# EasyEDA Pro project SRM_SuperCapacitor_S23_S24_.epro, schematic SCAP_Manage

## Sheets
1 主控: Create Date: 2024-01-11; Page Name: 主控; Project Name: TYT_SCAP_HW传家宝; Schematic Name: 超级电容管理_3; Update Date: 2024-01-11; Company: 嘉立创EDA; Page Size: B; Version: V1.0
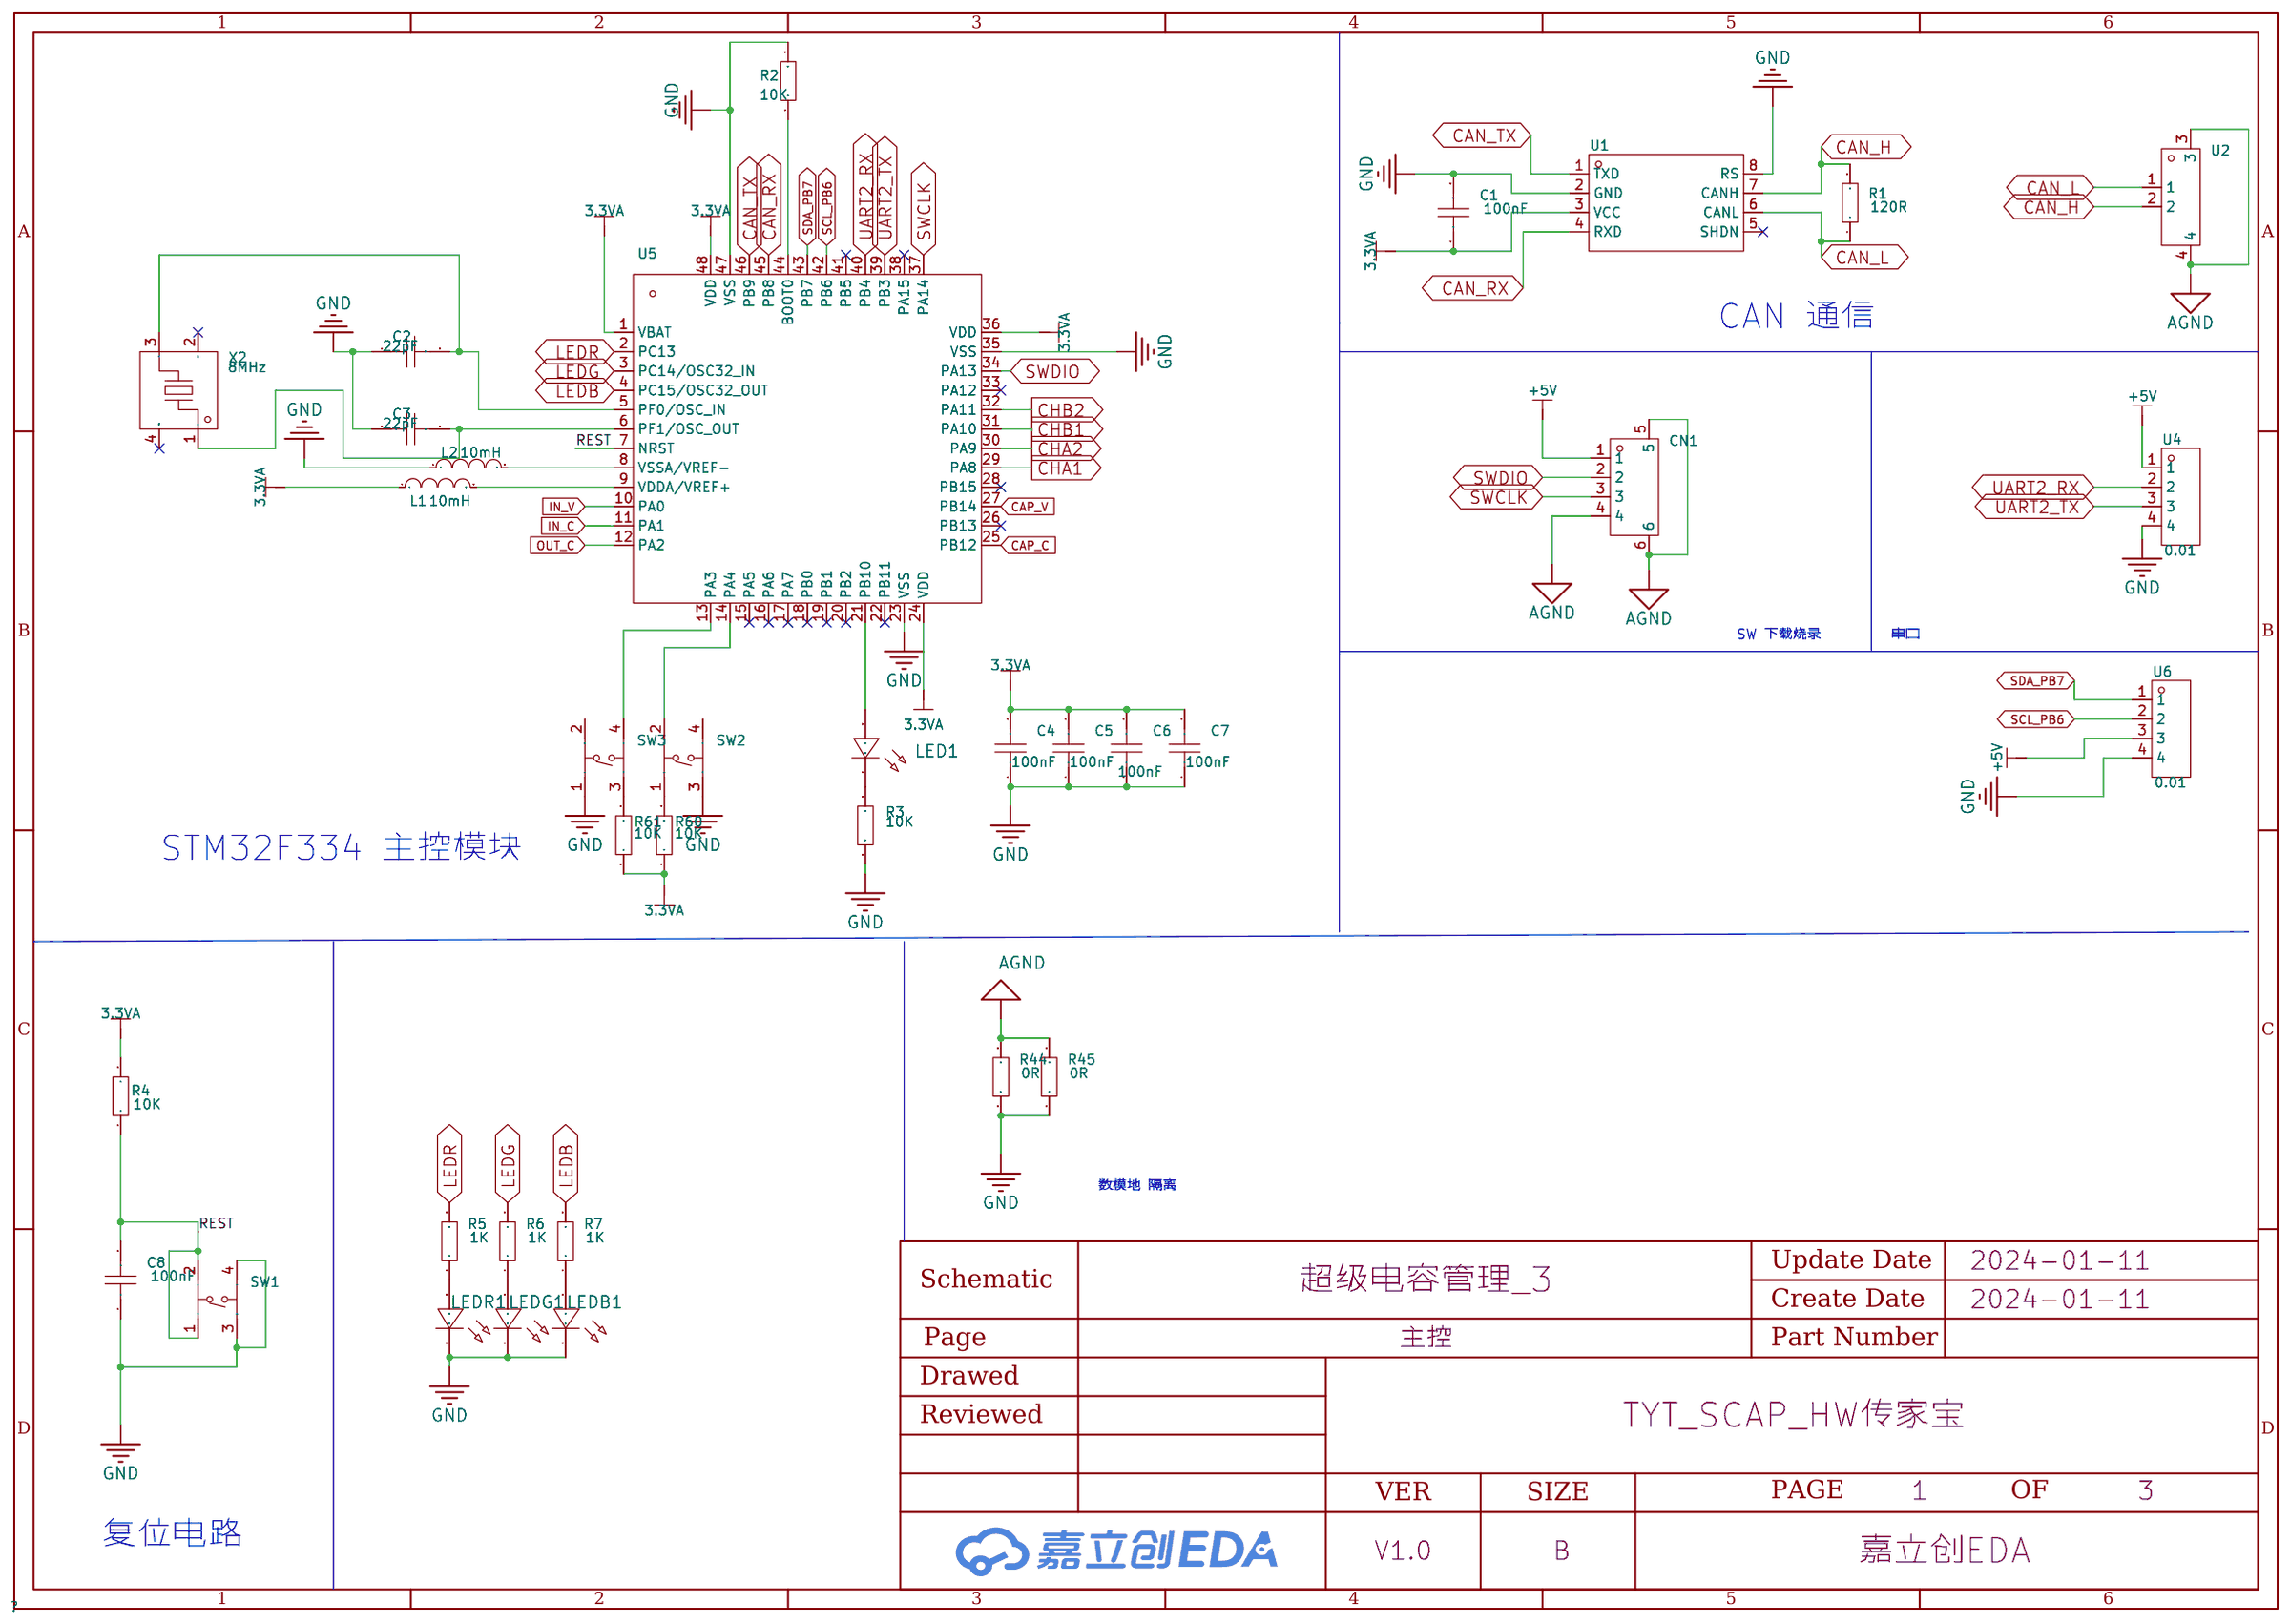
[diagram p0: 主控]
2 电源部分: Page Name: 电源部分; Project Name: SCAP_S23_S24; Schematic Name: SCAP_Manage; Update Date: 2024-04-11; Page Size: A4
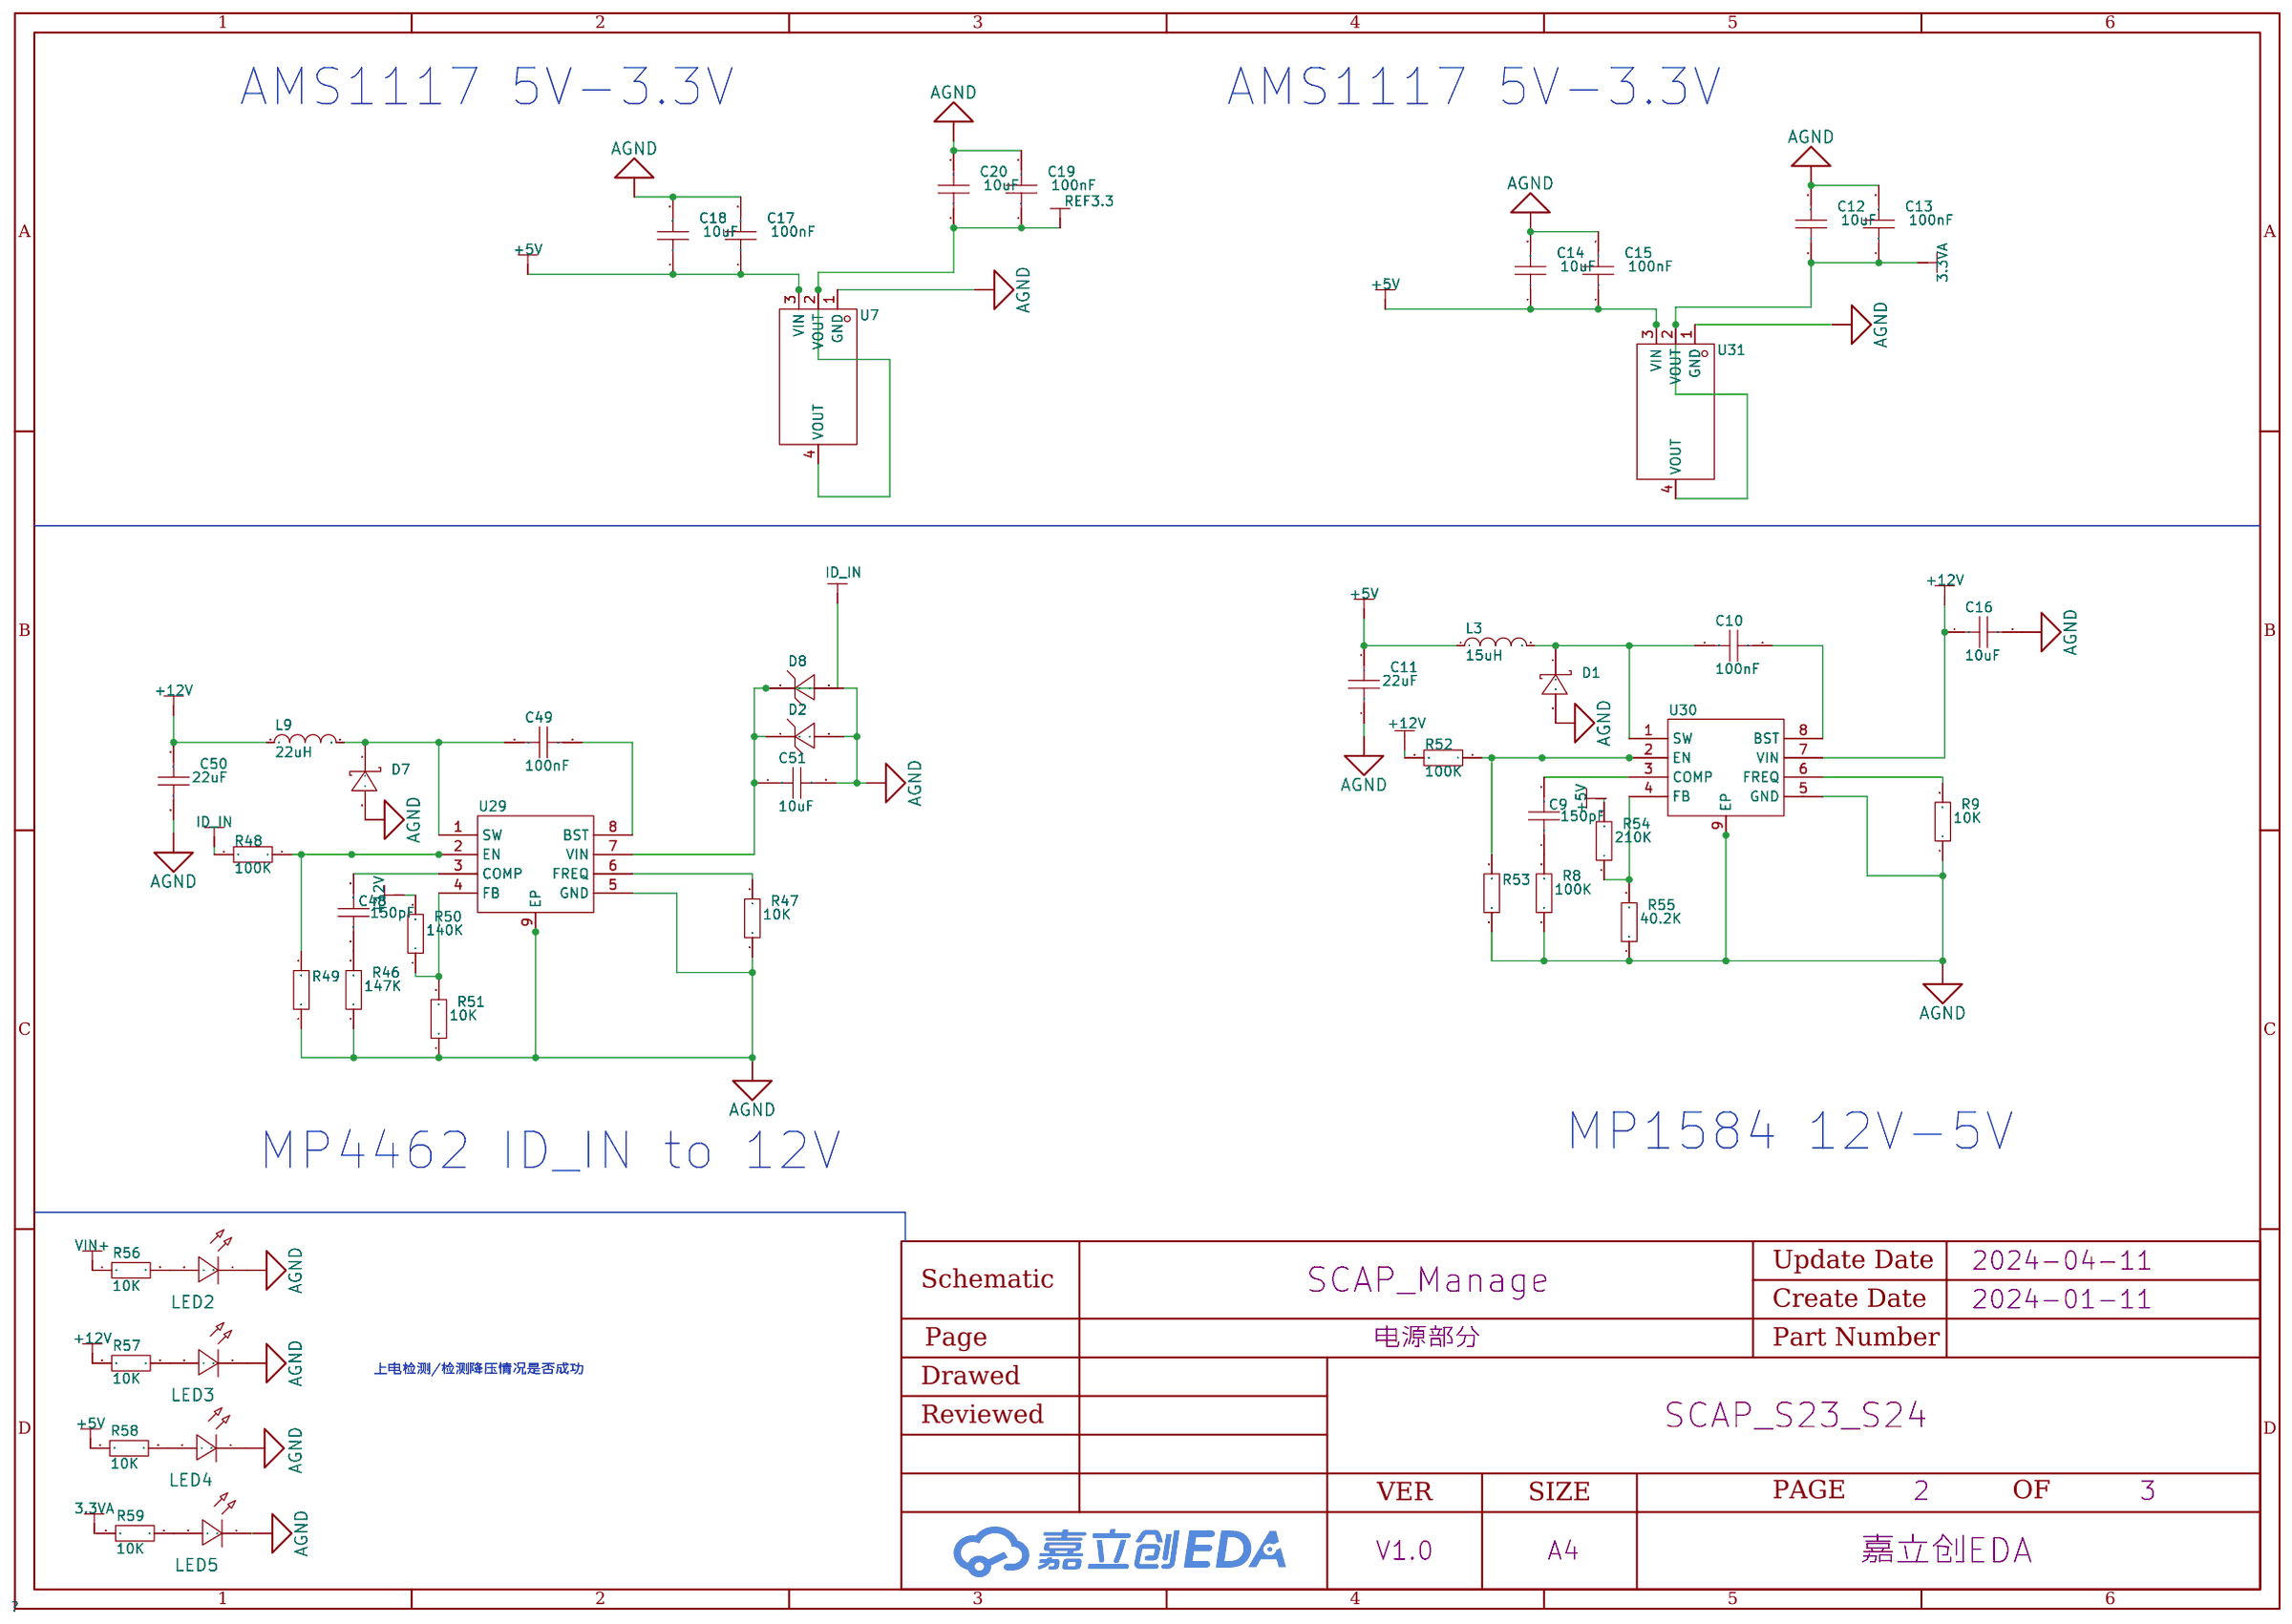
[diagram p1: 电源部分]
3 主拓扑: Page Name: 主拓扑; Project Name: SCAP_S23_S24; Schematic Name: SCAP_Manage; Update Date: 2024-05-25
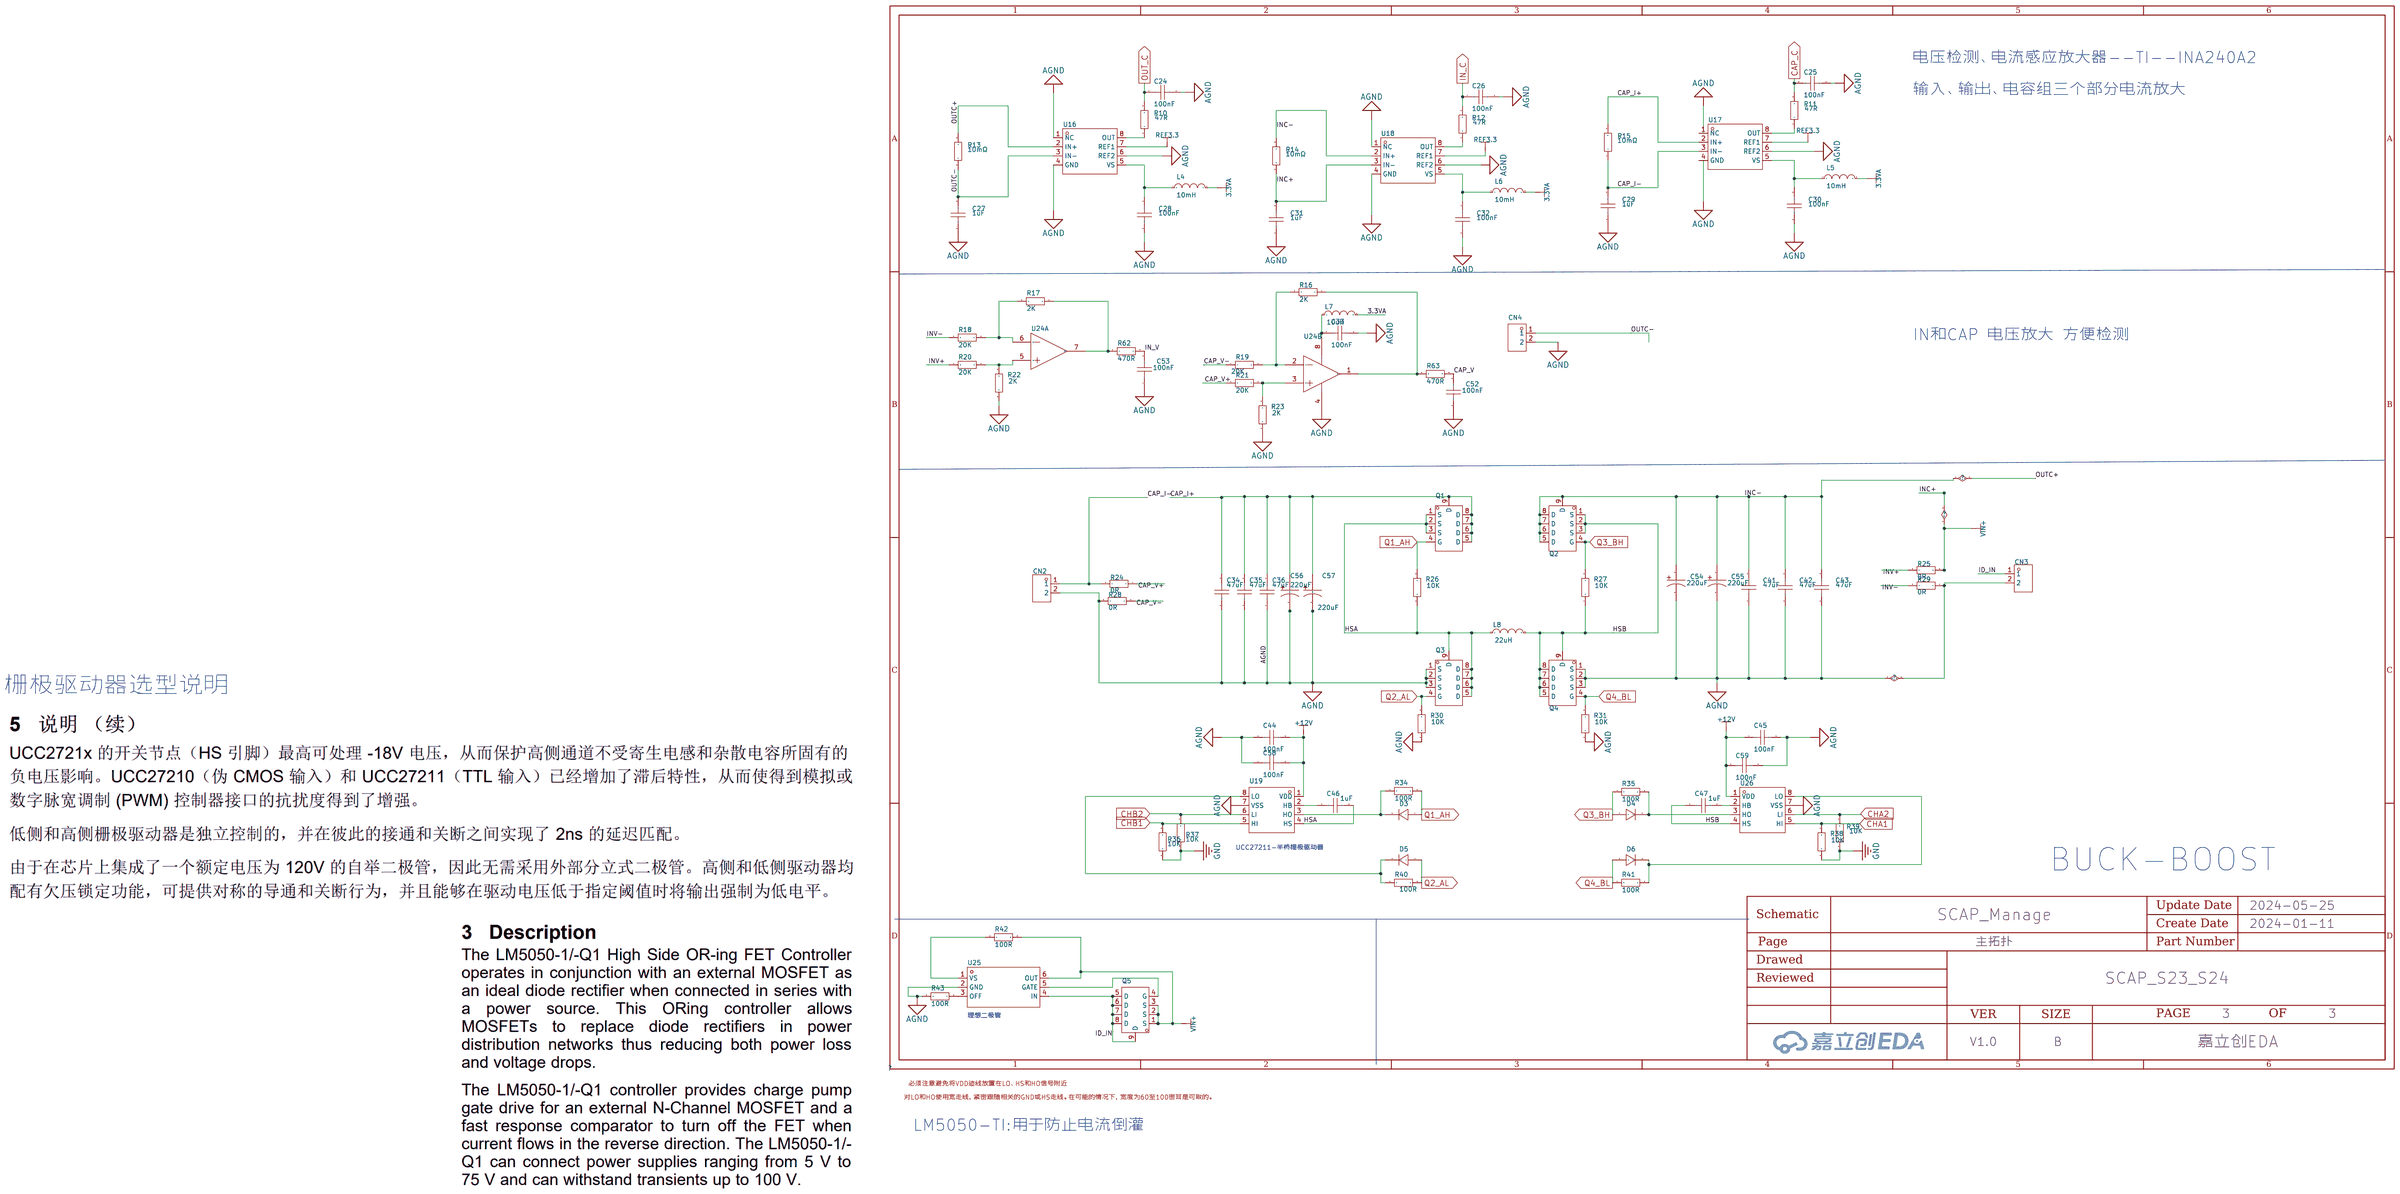
[diagram p2: 主拓扑]

## Parts
sheet 主拓扑
C24  100nF  [C0603]
C25  100nF  [C0603]
C26  100nF  [C0603]
C27  1uF  [C1206]
C28  100nF  [C0603]
C29  1uF  [C1206]
C30  100nF  [C0603]
C31  1uF  [C1206]
C32  100nF  [C0603]
C33  100nF  [C0603]
C34  47uF  [C1206]
C35  47uF  [C1206]
C36  47uF  [C1206]
C41  47uF  [C1206]
C42  47uF  [C1206]
C43  47uF  [C1206]
C44  100nF  [C0805]
C45  100nF  [C0805]
C46  1uF  [C0603]
C47  1uF  [C0603]
C52  100nF  [C0603]
C53  100nF  [C0603]
C54  220uF  [CAP-SMD_BD10.0-L10.3-W10.3-FD]
C55  220uF  [CAP-SMD_BD10.0-L10.3-W10.3-FD]
C56  220uF  [CAP-SMD_BD10.0-L10.3-W10.3-FD]
C57  220uF  [CAP-SMD_BD10.0-L10.3-W10.3-FD]
C58  100nF  [C0603]
C59  100nF  [C0603]
CN2  XT30U-M  [CONN-TH_XT30U-M]
CN3  XT30U-M  [CONN-TH_XT30U-M]
CN4  XT30U-M  [CONN-TH_XT30U-M]
D3  LL4148  [LL-34_L3.5-W1.5-R-RD]
D4  LL4148  [LL-34_L3.5-W1.5-R-RD]
D5  LL4148  [LL-34_L3.5-W1.5-R-RD]
D6  LL4148  [LL-34_L3.5-W1.5-R-RD]
L4  10mH  [L0603]
L5  10mH  [L0603]
L6  10mH  [L0603]
L7  10uH  [L0603]
L8  22uH  [IND-SMD_L17.5-W17.5]
Q1  CSD19534Q5A  [POWERVDFN-8_L6.0-W5.0-P1.27-BL]
Q2  CSD19534Q5A  [POWERVDFN-8_L6.0-W5.0-P1.27-BL]
Q3  CSD19534Q5A  [POWERVDFN-8_L6.0-W5.0-P1.27-BL]
Q4  CSD19534Q5A  [POWERVDFN-8_L6.0-W5.0-P1.27-BL]
Q5  CSD19534Q5A  [POWERVDFN-8_L6.0-W5.0-P1.27-BL]
R10  47R  [R0603]
R11  47R  [R0603]
R12  47R  [R0603]
R13  10mΩ  [R2512]
R14  10mΩ  [R2512]
R15  10mΩ  [R2512]
R16  2K  [R0603]
R17  2K  [R0603]
R18  20K  [R0603]
R19  20K  [R0603]
R20  20K  [R0603]
R21  20K  [R0603]
R22  2K  [R0603]
R23  2K  [R0603]
R24  0R  [R0603]
R25  0R  [R0603]
R26  10K  [R0603]
R27  10K  [R0603]
R28  0R  [R0603]
R29  0R  [R0603]
R30  10K  [R0603]
R31  10K  [R0603]
R34  100R  [R0603]
R35  100R  [R0603]
R36  10K  [R0603]
R37  10K  [R0603]
R38  10K  [R0603]
R39  10K  [R0603]
R40  100R  [R0603]
R41  100R  [R0603]
R42  100R  [R0603]
R43  100R  [R0603]
R62  470R  [R0603]
R63  470R  [R0603]
U16  INA240A2QPWRQ1  [TSSOP-8_L4.4-W3.0-P0.65-LS6.4-BL]
U17  INA240A2QPWRQ1  [TSSOP-8_L4.4-W3.0-P0.65-LS6.4-BL]
U18  INA240A2QPWRQ1  [TSSOP-8_L4.4-W3.0-P0.65-LS6.4-BL]
U19  UCC27211D  [SOIC-8_L4.9-W3.9-P1.27-LS6.0-BL]
U24  OPA2350UA/2K5  [SOIC-8_L4.9-W3.9-P1.27-LS6.0-BL]  (sections 1,2)
U25  LM5050MK-1/NOPB  [TSOT-23-6_L2.9-W1.6-P0.95-LS2.8-BR]
U26  UCC27211D  [SOIC-8_L4.9-W3.9-P1.27-LS6.0-BL]
sheet 主控
C1  100nF  [C0603]
C2  22pF  [C0603]
C3  22pF  [C0603]
C4  100nF  [C0603]
C5  100nF  [C0603]
C6  100nF  [C0603]
C7  100nF  [C0603]
C8  100nF  [C0603]
CN1  HC-1.25-4PLT  [CONN-SMD 4P-P1.25-L]
L1  10mH  [L0603]
L2  10mH  [L0603]
LED1  -  [LED0603-RD_BLUE]
LEDB1  -  [LED0603-RD_BLUE]
LEDG1  -  [LED0603-RD_BLUE]
LEDR1  -  [LED0603-RD_BLUE]
R1  120R  [R0603]
R2  10K  [R0603]
R3  10K  [R0603]
R4  10K  [R0603]
R5  1K  [R0603]
R6  1K  [R0603]
R7  1K  [R0603]
R44  0R  [R0603]
R45  0R  [R0603]
R60  10K  [R0603]
R61  10K  [R0603]
SW1  4.5*4.5*5  [SW-SMD_4P-L4.5-W4.5-P3.00-LS6.8]
SW2  4.5*4.5*5  [SW-SMD_4P-L4.5-W4.5-P3.00-LS6.8]
SW3  4.5*4.5*5  [SW-SMD_4P-L4.5-W4.5-P3.00-LS6.8]
U1  MAX3051ESA-T  [SOIC-8_L4.9-W3.9-P1.27-LS6.0-BL]
U2  JST_GH_BM02B-GHS-TBT_1x02-1MP_P1.25mm_Vertical  [CONN-SMD_2P-P1.25_GH1.25-2P]
U4  0.01  [排针2.54MM4P]
U5  STM32F334C8T6  [LQFP-48_L7.0-W7.0-P0.50-LS9.0-BL]
U6  0.01  [排针2.54MM4P]
X2  8MHz  [CRYSTAL-SMD_4P-L3.2-W2.5-BL-1]
sheet 电源部分
C9  150pF  [C0603]
C10  100nF  [C0603]
C11  22uF  [C1206]
C12  10uF  [C0603]
C13  100nF  [C0603]
C14  10uF  [C0603]
C15  100nF  [C0603]
C16  10uF  [C1206]
C17  100nF  [C0603]
C18  10uF  [C0603]
C19  100nF  [C0603]
C20  10uF  [C0603]
C48  150pF  [C0603]
C49  100nF  [C0603]
C50  22uF  [C1206]
C51  10uF  [C1206]
D1  SS34  [SMA_L4.3-W2.6-LS5.2-RD]
D2  SMBJ28A  [SMB_L4.6-W3.6-LS5.3-RD]
D7  SS34  [SMA_L4.3-W2.6-LS5.2-RD]
D8  SMBJ28A  [SMB_L4.6-W3.6-LS5.3-RD]
L3  15uH  [IND-SMD_L8.2-W8.2]
L9  22uH  [IND-SMD_L8.2-W8.2]
LED2  -  [LED0603-RD_BLUE]
LED3  -  [LED0603-RD_BLUE]
LED4  -  [LED0603-RD_BLUE]
LED5  -  [LED0603-RD_BLUE]
R8  100K  [R0603]
R9  10K  [R0603]
R46  147K  [R0603]
R47  10K  [R0603]
R48  100K  [R0603]
R49  24.9K  [R0603]
R50  140K  [R0603]
R51  10K  [R0603]
R52  100K  [R0603]
R53  24.9K  [R0603]
R54  210K  [R0603]
R55  40.2K  [R0603]
R56  10K  [R0603]
R57  10K  [R0603]
R58  10K  [R0603]
R59  10K  [R0603]
U7  AMS1117-3.3  [SOT-223-3_L6.5-W3.4-P2.30-LS7.0-BR]
U29  MP4462DN-LF-Z  [SOIC-8_L5.0-W4.0-P1.27-LS6.0-BL-EP2.0]
U30  MP1584EN-LF-Z  [SOIC-8_L5.0-W4.0-P1.27-LS6.0-BL-EP2.0]
U31  AMS1117-3.3  [SOT-223-3_L6.5-W3.4-P2.30-LS7.0-BR]

## Library data of the parts
C1-C10 C12-C15 C17-C20 C24-C26 C28 C30 C32-C36 C41-C43 C46-C49 C52 C53 C58 C59 = CAP_0603: Supplier Footprint: 0603
C11 C16 C27 C29 C31 C50 C51 = CAP_1206: Supplier Footprint: 1206
C44 C45 = CAP_0805: Supplier Footprint: 0805
C54-C57 = EEETK1V221UP: 容值:220uF;精度:±20%;额定电压:35V;电容体直径:10mm;电容体长度:10.2mm;纹波电流:-;等效串联电阻:-;工作寿命:3000hrs@125℃;工作温度:-40℃~+125℃;; LCSC Part Name: 220uF ±20% 35V; Supplier Part: C401923; Manufacturer: PANASONIC(松下); Supplier Footprint: SMD,D10xL10.2mm; JLCPCB Part Class: 扩展库; Datasheet: https://atta.szlcsc.com/upload/public/pdf/source/20190702/C401923_739061F274836EAB98E9496306A333BE.pdf; Supplier: LCSC; Tolerance: ±20%; Rated Voltage: 35V; φD: 10mm; L: 10.2mm; Lifetime @ Temp: 3000hrs@125℃; Operating Temperature: -40℃~+125℃
CN2-CN4 = XT30U-M: 模型插头轻量版锂电池插头; LCSC Part Name: XT30U-M 公头; Supplier Part: C99101; Manufacturer: AMASS(艾迈斯); JLCPCB Part Class: 扩展库; Datasheet: https://atta.szlcsc.com/upload/public/pdf/source/20170606/1496716542582.pdf; Supplier: LCSC
D3-D6 = LL4148_C9808: 反向恢复时间(trr):4ns;直流反向耐压(Vr):75V;平均整流电流(Io):200mA;二极管配置:-;正向压降(Vf):1V @ 10mA;; Supplier Part: C9808; Manufacturer: ST(先科); Supplier Footprint: LL-34; JLCPCB Part Class: 基础库; Datasheet: https://atta.szlcsc.com/upload/public/pdf/source/20121108/1457706554347.pdf; Supplier: LCSC
L1 L2 L4-L7 = L_0603
L8 = CDRH104NP-221MC: 电感值:220uH;; LCSC Part Name: 220uH; Supplier Part: C3000009; Manufacturer: Sumida(胜美达); Supplier Footprint: SMD,10.1x9.2x5.0mm; JLCPCB Part Class: 扩展库; Datasheet: https://atta.szlcsc.com/upload/public/pdf/source/20220630/F0472EA05CEA8ADE515F494D70F14BED.pdf; Supplier: LCSC
Q1-Q5 = CSD19534Q5A: 类型:N沟道;漏源电压(Vdss):100V;连续漏极电流(Id):50A;功率(Pd):3.2W;导通电阻(RDS(on)@Vgs,Id):15.1mΩ@10V,10A;阈值电压(Vgs(th)@Id):3.4V@250A;; LCSC Part Name: N沟道 100V 50A; Supplier Part: C114200; Manufacturer: TI(德州仪器); Supplier Footprint: VSONP-8; JLCPCB Part Class: 扩展库; Datasheet: https://atta.szlcsc.com/upload/public/pdf/source/20180327/C114200_E2928CC58FE965EB16585AC7A639EE46.pdf; Supplier: LCSC; Type: N沟道; Drain Source Voltage (Vdss): 100V; Continuous Drain Current (Id): 50A; Power Dissipation (Pd): 3.2W; Drain Source On Resistance (RDS(on)@Vgs,Id): 15.1mΩ@10V,10A; Gate Threshold Voltage (Vgs(th)@Id): 3.4V@250A
R1-R12 R16-R31 R34-R63 = Res_0603: Supplier Footprint: 0603
R13-R15 = MS122WF100MT4E: 阻值:10mΩ;精度:±1%;功率:2W;; LCSC Part Name: 10mΩ ±1% 2W; Supplier Part: C68609; Manufacturer: UNI-ROYAL(厚声); Supplier Footprint: 2512; JLCPCB Part Class: 扩展库; Datasheet: https://atta.szlcsc.com/upload/public/pdf/source/20170704/1499132968708.pdf; Supplier: LCSC; Tolerance: ±1%; Power(Watts): 2W
U16-U18 = INA240A2QPWRQ1: 运放类型:-;放大器组数:-;增益带宽积（GBP）:-;压摆率（SR）:-;电源电压:-;各通道供电电流:-;; Supplier Part: C544529; Manufacturer: TI(德州仪器); Supplier Footprint: TSSOP-8; Datasheet: https://atta.szlcsc.comnull; Supplier: LCSC
U19 U26 = UCC27211D: 驱动配置:半桥;负载类型:MOSFET;电源电压:8V~17V;峰值灌电流:4A;峰值拉电流:4A;; LCSC Part Name: 半桥 MOSFET 灌:4A 拉:4A; Supplier Part: C1549388; Manufacturer: TI(德州仪器); Supplier Footprint: SOIC-8; JLCPCB Part Class: 扩展库; Datasheet: https://atta.szlcsc.comnull; Supplier: LCSC; Driven Configuration: 半桥; Number of Drivers: 2; loadtype: MOSFET; Supply Voltage: 8V~17V; Peak Output Current(sink): 4A; Peak Output Current(source): 4A; Rise Time: 7.2ns; Fall Time: 5.5ns; Operating Temperature: -40℃~+140℃@(Tj)
U24 = OPA2350UA/2K5: 运放类型:General Purpose;放大器组数:2;增益带宽积（GBP）:38MHz;压摆率（SR）:22 V/us;电源电压:2.5V ~ 5.5V;各通道供电电流:5.2mA;; Supplier Part: C55904; Manufacturer: TI(德州仪器); Supplier Footprint: SOIC-8_150mil; JLCPCB Part Class: 扩展库; Datasheet: https://atta.szlcsc.com/upload/public/pdf/source/20150811/1457707345966.pdf; Supplier: LCSC; Amplifier Type: General Purpose; Number of Circuits: 2; Gain Bandwidth Product（GBP）: 38MHz; Slew Rate（SR）: 22 V/us; Supply Voltage（Single）: 2.5V ~ 5.5V; Iq per channel (Typ): 5.2mA
U25 = LM5050MK-1/NOPB: LM5050-1 高侧 ORing FET 控制器; Supplier Part: C129323; Manufacturer: TI(德州仪器); Supplier Footprint: TSOT-23-6; JLCPCB Part Class: 扩展库; Datasheet: https://atta.szlcsc.com/upload/public/pdf/source/20170914/C129323_1505359957620968163.pdf; Supplier: LCSC
CN1 = GH1.25-4P-L HC-1.25-4PLT: 参考系列:-;间距:1.25mm;插针结构:1x4P;排数:1;每排PIN数:4;行距:-;公母:公型插针;安装方式:立贴;额定电流:1A;工作温度范围:-25℃~+85℃;; LCSC Part Name: 4P 立贴 间距P=1.25mm; Supplier Part: C2845390; Manufacturer: HCTL(华灿天禄); Supplier Footprint: SMD,P=1.25mm; JLCPCB Part Class: 扩展库; Datasheet: https://atta.szlcsc.com/upload/public/pdf/source/20210729/C2845388_DE7B059A5B0AD47B2C737BA554D51F89.pdf; Supplier: LCSC; Pitch: 1.25mm; Pins Structure: 1x4P; Number of Rows: 1; Number of PINs Per Row: 4; Gender: 公型插针; Mounting Style: 立贴; Current Rating (Max): 1A; Operating Temperature Range: -25℃~+85℃
LED1-LED5 LEDB1 LEDG1 LEDR1 = LED_0603-R: 发光颜色:红灯;二极管配置:-;透镜颜色:无色透明;主波长:617.5nm;峰值波长:632nm;色温:-;光通量(25℃时):-;测试电流:5mA;正向电压(VF):2.2V;发光强度:28.5mcd;功率:60mW;发光角度:120°;安装方式:-;工作温度:-40℃~+85℃;; Supplier Footprint: 0603; Supplier Part: C72044
SW1-SW3 = 4.5*4.5*5: 额定电压(DC):12V;绝缘电阻:100MΩ;电路结构:单刀单掷;安装方式:立贴;按钮形状:圆形按钮;按钮/盖帽颜色:黑色;作用力:260gf@±50gf;机械寿命:100000;工作温度:-20℃~80℃;引脚样式:SMD接片;开关长度:4.5mm;开关宽度:4.5mm;开关高度:5mm;带支架:否;; LCSC Part Name: 4.5*4.5*5贴片编带; Supplier Part: C2923720; Manufacturer: BOOMELE(博穆精密); Supplier Footprint: SMD; JLCPCB Part Class: 扩展库; Datasheet: https://atta.szlcsc.com/upload/public/pdf/source/20211118/3FC0FEA3C7D6FAACB965A8D20B4AD8E9.pdf; Supplier: LCSC; Voltage Rating (DC): 12V; Insulation Resistance: 100MΩ; Circuit: 单刀单掷; Mounting Style: 立贴; Actuator Style: 圆形按钮; Actuator/Cap Color: 黑色; Operating Force: 260gf@±50gf; Mechanical Life: 100000; Operating Temperature: -20℃~80℃; Pin Style: SMD接片; Switch Length: 4.5mm; Switch Width: 4.5mm; Switch Height: 5mm; Strike Gundam: 否
U1 = MAX3051ESA-T: Supplier Part: C3214274; Manufacturer: MAXIM(美信); Datasheet: https://atta.szlcsc.comnull; Supplier: LCSC
U2 = JST_GH_BM02B-GHS-TBT_1x02-1MP_P1.25mm_Vertical: Supplier Part: C9900014934; Supplier Footprint: GH1.252P; JLCPCB Part Class: 扩展库; Datasheet: https://atta.szlcsc.comnull; Supplier: LCSC
U4 U6 = 排针4p-2.54mm直插: Supplier: 吉友; Price: 0.02
U5 = STM32F334C8T6: 主频（MAX):72MHz;工作电压:2V ~ 3.6V;; Supplier Part: C99450; Manufacturer: ST(意法半导体); Supplier Footprint: LQFP-48_7x7x05P; JLCPCB Part Class: 扩展库; Datasheet: https://atta.szlcsc.com/upload/public/pdf/source/20180105/C99450_15151501269081234225.pdf; Supplier: LCSC; Speed: 72MHz; Voltage - Supply (Vcc/Vdd): 2V ~ 3.6V; Program Memory Size: 64KB; RAM Size: 12KB; Number of I/O: 20; A/D: 15X12bit; D/A: 3x12bit; PWM: 23; UART/USART: 3 USART; CAN: 1; Features: IrDA,LIN
X2 = XL2EL89COI-111YLC-8M: 晶振类型:贴片无源晶振;频率:8MHz;频率公差:±10ppm;频率稳定度:±30ppm;负载电容:12pF;等效串联电阻(ESR):150Ω;工作温度:-40℃~+85℃;; LCSC Part Name: YSX321SL 8MHz ±10ppm 12pF; Supplier Part: C2973805; Manufacturer: YXC(扬兴晶振); Supplier Footprint: SMD3225-4P; JLCPCB Part Class: 扩展库; Datasheet: https://atta.szlcsc.com/upload/public/pdf/source/20220125/852C32DDA5BD01FF6A100E3BD98B4C83.pdf; Supplier: LCSC; Crystal Type: 贴片无源晶振; Frequency Tolerance: ±10ppm; Frequency Stability: ±30ppm; Load Capacitance: 12pF; Equivalent Series Resistance (ESR): 150Ω; Operating Temperature: -40℃~+85℃
D1 D7 = SS34_C8678: 二极管配置:独立式;直流反向耐压(Vr):40V;平均整流电流(Io):3A;正向压降(Vf):550mV@3A;反向电流(Ir):500uA@40V;; LCSC Part Name: 40V 3A 550mV@3A; Supplier Part: C8678; Manufacturer: MDD; Supplier Footprint: SMA(DO-214AC); JLCPCB Part Class: 基础库; Datasheet: https://atta.szlcsc.com/upload/public/pdf/source/20220408/D0396E57A6E83C6AFC0ED25EC9EDE030.pdf; Supplier: LCSC; Diode Configuration: 独立式; Reverse Voltage (Vr): 40V; Average Rectified Current (Io): 3A; Forward Voltage (Vf@If): 550mV@3A; Reverse Leakage Current (Ir): 500uA@40V
D2 D8 = SMBJ28A_C178227: 极性:单向;反向截止电压(Vrwm):28V;击穿电压:31.1V;峰值脉冲电流(Ipp)@10/1000s:-;最大钳位电压:45.4V;峰值脉冲功率(Ppp)@10/1000s:600W;; LCSC Part Name: 单向 Vrwm:28V 600W; Supplier Part: C178227; Manufacturer: Littelfuse(美国力特); Supplier Footprint: SMB(DO-214AA); JLCPCB Part Class: 扩展库; Datasheet: https://atta.szlcsc.com/upload/public/pdf/source/20180120/C178227_15164110619351284727.pdf; Supplier: LCSC; Polarity: 单向; Reverse Stand-Off Voltage (Vrwm): 28V; Breakdown Voltage: 31.1V; Maximum Clamping Voltage: 45.4V; Peak Pulse Power Dissipation (Ppp)@10/1000μs: 600W
L3 L9 = IHLP3232DZER220M11: 电感值:22uH;精度:±20%;额定电流:2.8A;饱和电流(Isat):2.8A;直流电阻(DCR):103mΩ;; LCSC Part Name: 22uH ±20% 2.8A 103mΩ; Supplier Part: C845053; Manufacturer: VISHAY(威世); Supplier Footprint: SMD,8.18x8.18mm; JLCPCB Part Class: 扩展库; Datasheet: https://atta.szlcsc.com/upload/public/pdf/source/20210629/C845053_EADDE65EF49F8D3E9B7D7378C31C84C8.pdf; Supplier: LCSC; Tolerance: ±20%; Rated Current: 2.8A; Saturation Current (Isat): 2.8A; DC Resistance (DCR): 103mΩ; Frequency - Self Resonant: 8.2MHz
U7 U31 = AMS1117-3.3_C6186: 输出类型:固定;输出极性:正;输出通道数:1;最大输入电压:-;输出电压:3.3V;压差:1.3V@(800mA);静态电流(地电流):-;输出电流:1A;电源纹波抑制比(PSRR):72dB@(120Hz);噪声:-;特性:-;工作温度:-;; LCSC Part Name: 正 Vout=3.3V 1A 72dB@(120Hz); Supplier Part: C6186; Manufacturer: AMS; Supplier Footprint: SOT-223-3; JLCPCB Part Class: 基础库; Datasheet: https://atta.szlcsc.com/upload/public/pdf/source/20180727/C6186_7A095716F0823C02F1997A905E26C086.pdf; Supplier: LCSC; Output Type: 固定; Output Polarity: 正; Number of Outputs: 1; Output Voltage: 3.3V; Dropout Voltage: 1.3V@(800mA); Output Current: 1A; Power Supply Rejection Ratio (PSRR): 72dB@(120Hz)
U29 = MP4462DN-LF-Z: Supplier Part: C28398; Supplier Footprint: SOIC-8_EP_150mil; JLCPCB Part Class: 扩展库; Supplier: LCSC
U30 = MP1584EN-LF-Z: Supplier Part: C15051; Supplier Footprint: SOIC-8_EP_150mil; JLCPCB Part Class: 扩展库; Supplier: LCSC

## Nets
3.3VA: C1.1 C4.2 C5.2 C6.2 C7.2 C12.1 C13.1 L1.1 L4.2 L5.2 L6.2 L7.2 R4.2 R59.1 R60.1 R61.1 U1.3(VCC) U5.1(VBAT) U5.24(VDD) U5.36(VDD) U5.48(VDD) U31.2(VOUT) U31.4(VOUT)
+5V: C11.2 C14.1 C15.1 C17.1 C18.1 CN1.1 L3.1 R54.2 R58.1 U4.1 U6.3 U7.3(VIN) U31.3(VIN)
+12V: C16.1 C44.2 C45.1 C50.2 C58.2 C59.1 L9.1 R50.2 R52.2 R57.1 U19.1(VDD) U26.1(VDD) U30.7(VIN)
AGND: C11.1 C12.2 C13.2 C14.2 C15.2 C16.2 C17.2 C18.2 C19.2 C20.2 C24.2 C25.2 C26.2 C27.1 C28.2 C29.1 C30.2 C31.1 C32.2 C33.2 C34.1 C35.1 C36.1 C41.1 C42.1 C43.1 C44.1 C45.2 C50.1 C51.2 C52.1 C53.1 C54.2 C55.2 C56.2 C57.2 C58.1 C59.2 CN1.4 CN1.5 CN1.6 CN2.2 CN3.2 CN4.2 D1.2(A) D2.2(A) D7.2(A) D8.2(A) LED2.1(C) LED3.1(C) LED4.1(C) LED5.1(C) Q3.1(S) Q3.2(S) Q3.3(S) Q4.1(S) Q4.2(S) Q4.3(S) R8.1 R9.1 R22.1 R23.1 R28.2 R29.1 R30.1 R31.1 R43.1 R44.2 R45.2 R46.1 R47.1 R49.1 R51.1 R53.1 R55.1 U2.3 U2.4 U7.1(GND) U16.1(NC) U16.4(GND) U16.6(REF2) U17.1(NC) U17.4(GND) U17.6(REF2) U18.1(NC) U18.4(GND) U18.6(REF2) U19.7(VSS) U24.4(V-) U25.2(GND) U26.7(VSS) U29.5(GND) U29.9(EP) U30.5(GND) U30.9(EP) U31.1(GND)
GND: C1.2 C2.1 C3.1 C4.1 C5.1 C6.1 C7.1 C8.1 L2.1 LEDB1.1(C) LEDG1.1(C) LEDR1.1(C) R2.2 R3.2 R36.1 R37.1 R38.1 R39.1 R44.1 R45.1 SW1.3 SW1.4 SW2.3 SW3.1 U1.2(GND) U1.8(RS) U4.4 U5.23(VSS) U5.35(VSS) U5.47(VSS) U6.4
VIN+: C31.2 Q5.1(S) Q5.2(S) Q5.3(S) R14.1 R25.1 R42.2 R56.1 U18.3(IN-) U25.6(OUT)
CAN_H: R1.2 U1.7(CANH) U2.2
CAN_L: R1.1 U1.6(CANL) U2.1
CAN_RX: U1.4(RXD) U5.45(PB8)
CAN_TX: U1.1(TXD) U5.46(PB9)
CAP_C: C25.1 R11.2 U5.25(PB12)
CAP_I+: C34.2 C35.2 C36.2 C56.1 C57.1 Q1.5(D) Q1.6(D) Q1.7(D) Q1.8(D) Q1.9(D) R15.2 U17.2(IN+)
CAP_I-: C29.2 CN2.1 R15.1 R24.2 U17.3(IN-)
CAP_V: C52.2 R63.2 U5.27(PB14)
CAP_V+: R21.1 R24.1
CAP_V-: R19.1 R28.1
CHA1: R38.2 U5.29(PA8) U26.5(HI)
CHA2: R39.2 U5.30(PA9) U26.6(LI)
CHB1: R36.2 U5.31(PA10) U19.5(HI)
CHB2: R37.2 U5.32(PA11) U19.6(LI)
HSA: C46.2 L8.1 Q1.1(S) Q1.2(S) Q1.3(S) Q3.5(D) Q3.6(D) Q3.7(D) Q3.8(D) Q3.9(D) R26.1 U19.4(HS)
HSB: C47.1 L8.2 Q2.1(S) Q2.2(S) Q2.3(S) Q4.5(D) Q4.6(D) Q4.7(D) Q4.8(D) Q4.9(D) R27.1 U26.4(HS)
ID_IN: C51.1 CN3.1 D2.1(C) D8.1(C) Q5.5(D) Q5.6(D) Q5.7(D) Q5.8(D) Q5.9(D) R48.2 U25.4(IN) U29.7(VIN)
IN_C: C26.1 R12.2 U5.11(PA1)
IN_V: C53.2 R62.2 U5.10(PA0)
INC-: C41.2 C42.2 C43.2 C54.1 C55.1 Q2.5(D) Q2.6(D) Q2.7(D) Q2.8(D) Q2.9(D) R13.2 R14.2 U16.2(IN+) U18.2(IN+)
INV+: R20.1 R25.2
INV-: R18.1 R29.2
LEDB: R7.2 U5.4(PC15/OSC32_OUT)
LEDG: R6.2 U5.3(PC14/OSC32_IN)
LEDR: R5.2 U5.2(PC13)
OUT_C: C24.1 R10.2 U5.12(PA2)
OUTC-: C27.2 CN4.1 R13.1 U16.3(IN-)
Q1_AH: D3.1(A) Q1.4(G) R26.2 R34.2
Q2_AL: D5.1(A) Q3.4(G) R30.2 R40.2
Q3_BH: D4.1(A) Q2.4(G) R27.2 R35.1
Q4_BL: D6.1(A) Q4.4(G) R31.2 R41.1
REF3.3: C19.1 C20.1 U7.2(VOUT) U7.4(VOUT) U16.7(REF1) U17.7(REF1) U18.7(REF1)
REST: C8.2 R4.1 SW1.1 SW1.2 U5.7(NRST)
SCL_PB6: U5.42(PB6) U6.2
SDA_PB7: U5.43(PB7) U6.1
SWCLK: CN1.3 U5.37(PA14)
SWDIO: CN1.2 U5.34(PA13)
UART2_RX: U4.2 U5.40(PB4)
UART2_TX: U4.3 U5.39(PB3)
$1N2946: L1.2 U5.9(VDDA/VREF+)
$1N3057: L2.2 U5.8(VSSA/VREF-)
$1N3165: R2.1 U5.44(BOOT0)
$1N4888: C2.2 U5.5(PF0/OSC_IN) X2.3
$1N4898: C3.2 U5.6(PF1/OSC_OUT) X2.1
$1N5715: LED1.1(C) R3.1
$1N15621: LEDB1.2(A) R7.1
$1N15623: LEDG1.2(A) R6.1
$1N15625: LEDR1.2(A) R5.1
$1N20395: LED1.2(A) U5.21(PB10)
$1N30684: SW3.4 U5.13(PA3)
$1N30718: SW2.2 U5.14(PA4)
$1N31316: R60.2 SW2.1
$1N31414: R61.2 SW3.3
$2N24230: C48.2 U29.3(COMP)
$2N24362: C48.1 R46.2
$2N24606: C49.1 D7.1(K) L9.2 U29.1(SW)
$2N24634: C49.2 U29.8(BST)
$2N24808: R47.2 U29.6(FREQ)
$2N25760: R48.1 R49.2 U29.2(EN)
$2N27719: R50.1 R51.2 U29.4(FB)
$2N28734: C9.1 R8.2
$2N28735: C10.2 U30.8(BST)
$2N28736: R9.2 U30.6(FREQ)
$2N28738: C10.1 D1.1(K) L3.2 U30.1(SW)
$2N28745: R52.1 R53.2 U30.2(EN)
$2N28746: C9.2 U30.3(COMP)
$2N28748: R54.1 R55.2 U30.4(FB)
$2N30570: LED2.2(A) R56.2
$2N30685: LED3.2(A) R57.2
$2N30800: LED4.2(A) R58.2
$2N31488: LED5.2(A) R59.2
$3N21120: D5.2(K) R40.1 U19.8(LO)
$3N22030: D3.2(K) R34.1 U19.3(HO)
$3N22705: D4.2(K) R35.2 U26.3(HO)
$3N22762: D6.2(K) R41.2 U26.8(LO)
$3N24747: C47.2 U26.2(HB)
$3N25074: C46.1 U19.2(HB)
$3N58424: R17.2 R18.2 U24.6(IN B-)
$3N58515: R20.2 R22.2 U24.5(IN B+)
$3N59481: R17.1 R62.1 U24.7(OUT B)
$3N61224: R16.2 R19.2 U24.2(IN A-)
$3N61572: R16.1 R63.1 U24.1(OUT A)
$3N62131: R21.2 R23.2 U24.3(IN A+)
$3N63447: C33.1 L7.1 U24.8(V+)
$3N69839: R10.1 U16.8(OUT)
$3N70200: C28.1 L4.1 U16.5(VS)
$3N73306: R12.1 U18.8(OUT)
$3N73310: C32.1 L6.1 U18.5(VS)
$3N75080: C30.1 L5.1 U17.5(VS)
$3N75083: R11.1 U17.8(OUT)
$3N79974: R42.1 U25.1(VS)
$3N80559: R43.2 U25.3(OFF)
$3N81159: Q5.4(G) U25.5(GATE)

Not connected (* = marked no-connect by the designer): SW2 4; SW3 2; U1 5(SHDN)*; U5 15(PA5)* 16(PA6)* 17(PA7)* 18(PB0)* 19(PB1)* 20(PB2)* 22(PB11)* 26(PB13)* 28(PB15)* 33(PA12)* 38(PA15)* 41(PB5)*; X2 2(GND)* 4(GND)*

## Notes on the sheets
sheet 1
- CAN 通信
- SW 下载烧录
- 串口
- STM32F334 主控模块
- 数模地 隔离
- 复位电路
sheet 2
- AMS1117 5V-3.3V
- AMS1117 5V-3.3V
- MP1584 12V-5V
- MP4462 ID_IN to 12V
- 上电检测/检测降压情况是否成功
sheet 3
- 电压检测、电流感应放大器--TI--INA240A2
- 输入、输出、电容组三个部分电流放大
- IN和CAP 电压放大 方便检测
- 栅极驱动器选型说明
- UCC27211-半桥栅极驱动器
- BUCK-BOOST
- 理想二极管
- 必须注意避免将VDD迹线放置在LO、HS和HO信号附近
- 对LO和HO使用宽走线，紧密跟随相关的GND或HS走线。在可能的情况下，宽度为60至100密耳是可取的。
- LM5050-TI:用于防止电流倒灌
